# Altium schematic sheet 01_DesignBlock.SchDoc
size 297 x 209 mm
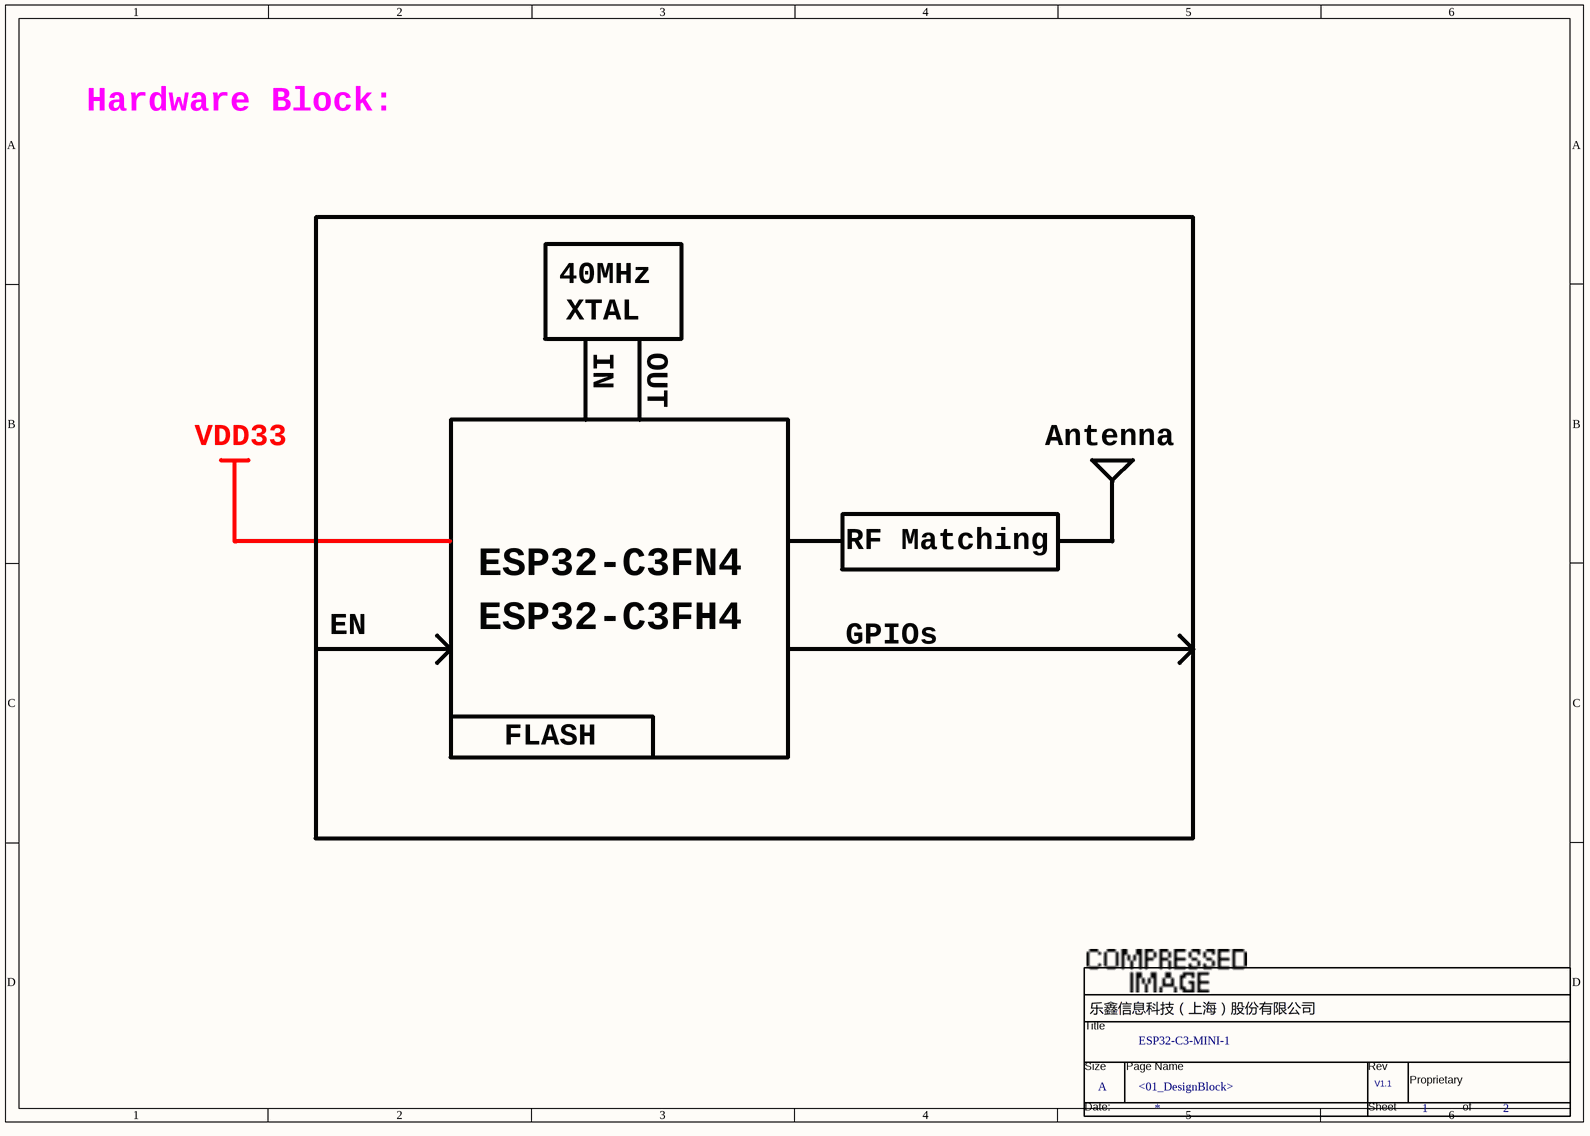
[diagram p0: 01_DesignBlock.SchDoc]

## Parts
*  Doc: <01_DesignBlock>  Title: ESP32-C3-MINI-1  Page Size: A  Page Number: 1  Page Count: 2  RevCode: V1.1  (hidden comment: espTitleBlock3)  (graphical)

## Notes on the sheet
- Hardware Block:
- 40MHz
- XTAL
- IN
- OUT
- VDD33
- Antenna
- ESP32-C3FN4
- RF Matching
- EN
- ESP32-C3FH4
- GPIOs
- FLASH
- (in symbol espTitleBlock3) Title; Size; Page Name; Rev; Proprietary; Date:; Sheet; of

## Library data of the parts
* = espTitleBlock3: Page Name: V; Page Create Date: March  8, 1995; Page Modify Date: *